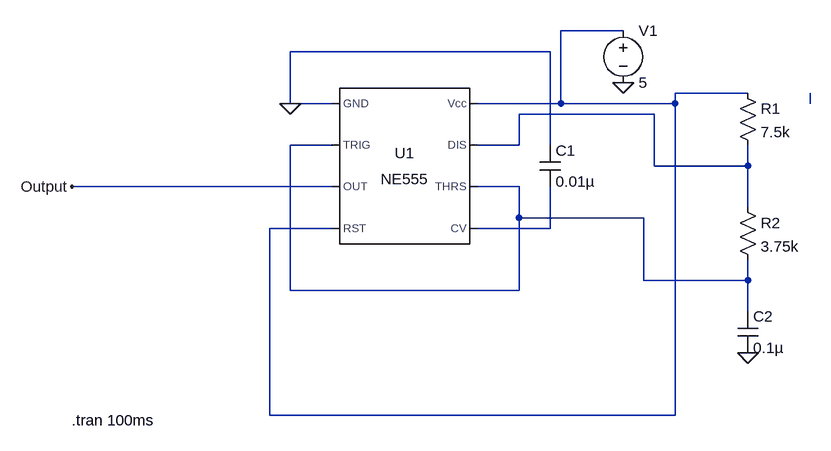
[diagram p0: schematic ASTABLE_MULTI_VIBRATOR.asc]
ASTABLE_MULTI_VIBRATOR.asc, the LTspice schematic file:
Version 4
SHEET 1 880 680
WIRE 544 -16 448 -16
WIRE 432 16 32 16
WIRE 736 80 624 80
WIRE 32 96 32 16
WIRE 96 96 32 96
WIRE 448 96 448 -16
WIRE 448 96 320 96
WIRE 624 96 624 80
WIRE 624 96 448 96
WIRE 832 96 832 80
WIRE 592 112 384 112
WIRE 96 160 32 160
WIRE 384 160 384 112
WIRE 384 160 320 160
WIRE 432 160 432 16
WIRE 592 192 592 112
WIRE 736 192 736 160
WIRE 736 192 592 192
WIRE 96 224 -304 224
WIRE 384 224 320 224
WIRE 736 256 736 192
WIRE 384 272 384 224
WIRE 576 272 384 272
WIRE 96 288 0 288
WIRE 432 288 432 224
WIRE 432 288 320 288
WIRE 576 368 576 272
WIRE 736 368 736 336
WIRE 736 368 576 368
WIRE 32 384 32 160
WIRE 384 384 384 272
WIRE 384 384 32 384
WIRE 736 416 736 368
WIRE 0 576 0 288
WIRE 624 576 624 96
WIRE 624 576 0 576
FLAG 32 96 0
FLAG 736 480 0
FLAG 544 64 0
FLAG -304 224 Output
SYMBOL Misc\\NE555 208 192 R0
SYMATTR InstName U1
SYMBOL cap 416 160 R0
SYMATTR InstName C1
SYMATTR Value 0.01µ
SYMBOL res 720 64 R0
SYMATTR InstName R1
SYMATTR Value 7.5k
SYMBOL res 720 240 R0
SYMATTR InstName R2
SYMATTR Value 3.75k
SYMBOL cap 720 416 R0
SYMATTR InstName C2
SYMATTR Value 0.1µ
SYMBOL voltage 544 -32 R0
WINDOW 123 0 0 Left 0
WINDOW 39 0 0 Left 0
SYMATTR InstName V1
SYMATTR Value 5
TEXT -304 584 Left 2 !.tran 100ms

The netlist it stands for:
* ASTABLE_MULTI_VIBRATOR.asc
XU1 0 N004 Output N001 N005 N004 N003 N001 NE555  ; pins GND TRIG OUT RST CV THRS DIS Vcc
C1 0 N005 0.01µ
R1 N001 N003 7.5k
R2 N003 N004 3.75k
C2 N004 0 0.1µ
V1 N001 0 5
.tran 100ms
.lib NE555.sub
.backanno
.end